# EAGLE schematic lab01sol (EAGLE 8.7.1)
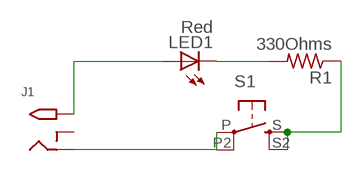
[diagram p0: schematic, sheet 1]

## Parts
J1  2.1MMJACKTHM  [PJ-102A]
LED1  Red  LED5MM  [LED5MM]
R1  330Ohms  RESISTORTH-1/4W-CARBON  [RESAD1160W55L680D260_HS]
S1  BUTTON-TACTILE-SQUARE  [BUTTON-TACTILE-SQUARE-ADAFRUIT1010]

## Nets
N$1: LED1.K(C) R1.2
N$2: R1.1 S1.S S1.S2(S1)
N$3: J1.RING S1.P S1.P2(P1)
N$4: J1.TIP LED1.A
Unconnected: J1.RING_SW

## Library data of the parts
J1 = Lab01:2.1MMJACK: 2.1mm x 5.5mm THM DC jack with internal switch. Digikey part #PJ-102A, 4UCON part #05537 2.1mm x 5.5mm SMT DC jack with internal switch. Digikey part #PJ-002A-SMT, 4UCON part #03267 By microbuilder.eu & adafruit.com; CREATOR: Swanson; DIST: Digikey; DISTPN: CP-102A-ND; REVIEWER: Swanson
LED1 = Lab01:LED: /; CREATOR: Swanson; DIST: Adafruit; DISTPN: 297; REVIEWER: Swanson
R1 = Lab01:RESISTOR; CREATOR: Swanson; DIST: Digikey; DISTPN: 100QTR-ND; REVIEWER: Swanson
S1 = Lab01:BUTTON-TACTILE; CREATOR: Swanson; DIST: Adafruit; DISTPN: 1010; REVIEWER: Swanson